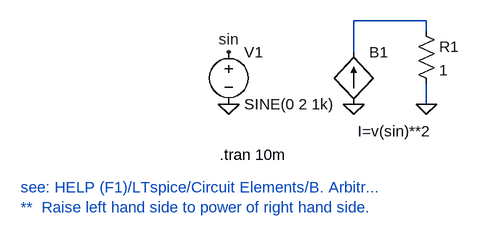
[diagram p0: schematic square_current.asc]
square_current.asc, the LTspice schematic file:
Version 4
SHEET 1 880 680
WIRE 368 48 256 48
WIRE 368 64 368 48
WIRE 256 96 256 48
WIRE 368 176 368 144
FLAG 64 176 0
FLAG 64 96 sin
FLAG 256 176 0
FLAG 368 176 0
SYMBOL voltage 64 80 R0
WINDOW 123 0 0 Left 0
WINDOW 39 0 0 Left 0
SYMATTR InstName V1
SYMATTR Value SINE(0 2 1k)
SYMBOL bi2 256 96 R0
WINDOW 3 6 122 Left 0
SYMATTR InstName B1
SYMATTR Value I=v(sin)**2
SYMBOL res 352 48 R0
SYMATTR InstName R1
SYMATTR Value 1
TEXT 50 254 Left 0 !.tran 10m
TEXT -256 304 Left 0 ;see: HELP (F1)/LTspice/Circuit Elements/B. Arbitr...\n**  Raise left hand side to power of right hand side.

The netlist it stands for:
* square_current.asc
V1 sin 0 SINE(0 2 1k)
B1 0 N001 I=v(sin)**2
R1 N001 0 1
.tran 10m
* see: HELP (F1)/LTspice/Circuit Elements/B. Arbitr...
* **  Raise left hand side to power of right hand side.
.backanno
.end